# EAGLE design shift_reg (EAGLE 9.5.1)
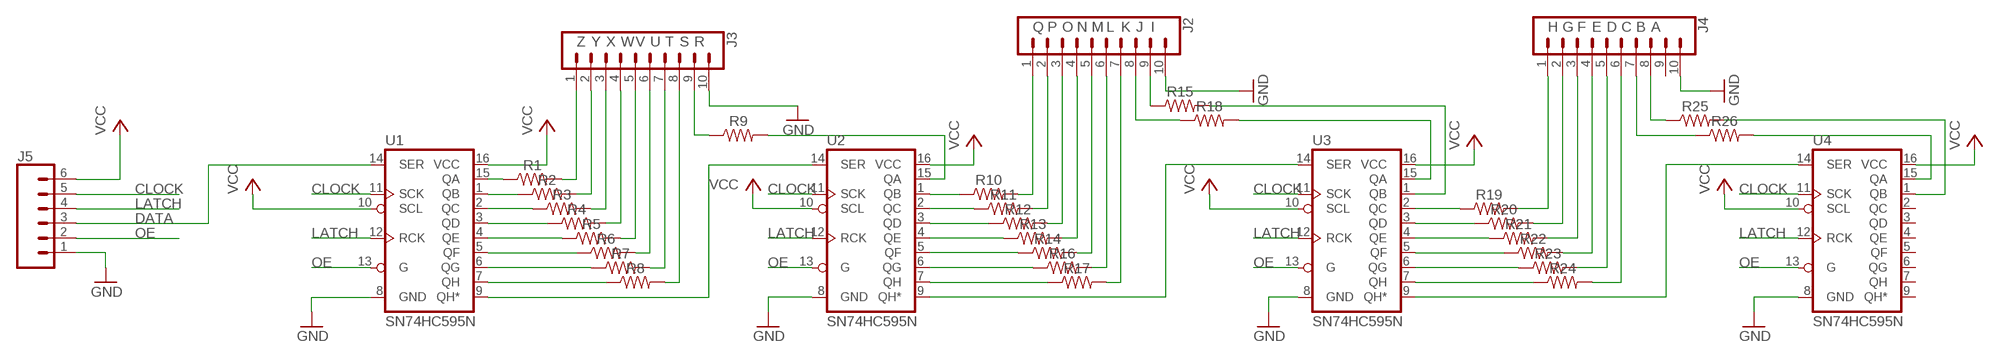
[diagram p0: schematic, sheet 1]

## Parts
J2  CONN_10"  [1X10]
J3  CONN_10"  [1X10]
J4  CONN_10"  [1X10]
J5  CONN_06LOCK  [1X06_LOCK]
R1  RESISTORAXIAL-0.3  [AXIAL-0.3]
R2  RESISTORAXIAL-0.3  [AXIAL-0.3]
R3  RESISTORAXIAL-0.3  [AXIAL-0.3]
R4  RESISTORAXIAL-0.3  [AXIAL-0.3]
R5  RESISTORAXIAL-0.3  [AXIAL-0.3]
R6  RESISTORAXIAL-0.3  [AXIAL-0.3]
R7  RESISTORAXIAL-0.3  [AXIAL-0.3]
R8  RESISTORAXIAL-0.3  [AXIAL-0.3]
R9  RESISTORAXIAL-0.3  [AXIAL-0.3]
R10  RESISTORAXIAL-0.3  [AXIAL-0.3]
R11  RESISTORAXIAL-0.3  [AXIAL-0.3]
R12  RESISTORAXIAL-0.3  [AXIAL-0.3]
R13  RESISTORAXIAL-0.3  [AXIAL-0.3]
R14  RESISTORAXIAL-0.3  [AXIAL-0.3]
R15  RESISTORAXIAL-0.3  [AXIAL-0.3]
R16  RESISTORAXIAL-0.3  [AXIAL-0.3]
R17  RESISTORAXIAL-0.3  [AXIAL-0.3]
R18  RESISTORAXIAL-0.3  [AXIAL-0.3]
R19  RESISTORAXIAL-0.3  [AXIAL-0.3]
R20  RESISTORAXIAL-0.3  [AXIAL-0.3]
R21  RESISTORAXIAL-0.3  [AXIAL-0.3]
R22  RESISTORAXIAL-0.3  [AXIAL-0.3]
R23  RESISTORAXIAL-0.3  [AXIAL-0.3]
R24  RESISTORAXIAL-0.3  [AXIAL-0.3]
R25  RESISTORAXIAL-0.3  [AXIAL-0.3]
R26  RESISTORAXIAL-0.3  [AXIAL-0.3]
U1  SN74HC595N  74HC595N  [DIP16]
U2  SN74HC595N  74HC595N  [DIP16]
U3  SN74HC595N  74HC595N  [DIP16]
U4  SN74HC595N  74HC595N  [DIP16]

## Nets
A: J4.8 R25.P$1
B: J4.7 R26.P$1
C: J4.6 R24.P$2
CLOCK: J5.5 U1.11(SCK) U2.11(SCK) U3.11(SCK) U4.11(SCK)
D: J4.5 R23.P$2
DATA: J5.3 U1.14(SER)
E: J4.4 R22.P$2
F: J4.3 R21.P$2
G: J4.2 R20.P$2
GND: J2.10 J3.10 J4.10 J5.1 U1.8(GND) U2.8(GND) U3.8(GND) U4.8(GND)
H: J4.1 R19.P$2
I: J2.9 R15.P$1
J: J2.8 R18.P$1
K: J2.7 R17.P$2
L: J2.6 R16.P$2
LATCH: J5.4 U1.12(RCK) U2.12(RCK) U3.12(RCK) U4.12(RCK)
M: J2.5 R14.P$2
N: J2.4 R13.P$2
N$2: U1.9(QH*) U2.14(SER)
N$3: R9.P$2 U2.15(QA)
N$4: R14.P$1 U2.5(QF)
N$6: R18.P$2 U3.15(QA)
N$7: R15.P$2 U3.1(QB)
N$9: R1.P$1 U1.15(QA)
N$10: R2.P$1 U1.1(QB)
N$11: R3.P$1 U1.2(QC)
N$12: R4.P$1 U1.3(QD)
N$13: R5.P$1 U1.4(QE)
N$14: R6.P$1 U1.5(QF)
N$15: R7.P$1 U1.6(QG)
N$16: R8.P$1 U1.7(QH)
N$19: R10.P$1 U2.1(QB)
N$20: R11.P$1 U2.2(QC)
N$21: R12.P$1 U2.3(QD)
N$22: R13.P$1 U2.4(QE)
N$23: R16.P$1 U2.6(QG)
N$24: R17.P$1 U2.7(QH)
N$26: R19.P$1 U3.2(QC)
N$27: R20.P$1 U3.3(QD)
N$28: U2.9(QH*) U3.14(SER)
N$29: R21.P$1 U3.4(QE)
N$30: R22.P$1 U3.5(QF)
N$31: R23.P$1 U3.6(QG)
N$32: R24.P$1 U3.7(QH)
N$35: R26.P$2 U4.15(QA)
N$36: R25.P$2 U4.1(QB)
N$37: U3.9(QH*) U4.14(SER)
O: J2.3 R12.P$2
OE: J5.2 U1.13(G) U2.13(G) U3.13(G) U4.13(G)
P: J2.2 R11.P$2
Q: J2.1 R10.P$2
R: J3.9 R9.P$1
S: J3.8 R8.P$2
T: J3.7 R7.P$2
U: J3.6 R6.P$2
V: J3.5 R5.P$2
VCC: J5.6 U1.10(SCL) U1.16(VCC) U2.10(SCL) U2.16(VCC) U3.10(SCL) U3.16(VCC) U4.10(SCL) U4.16(VCC)
W: J3.4 R4.P$2
X: J3.3 R3.P$2
Y: J3.2 R2.P$2
Z: J3.1 R1.P$2
Unconnected: J4.9 U4.2(QC) U4.3(QD) U4.4(QE) U4.5(QF) U4.6(QG) U4.7(QH) U4.9(QH*)

## Library data of the parts
J2-J4 = shift_register:CONN_10: Multi connection point. Often used as Generic Header-pin footprint for 0.1 inch spaced/style header connections On any of the 0.1 inch spaced packages, you can populate with these: Break Away Headers - Straight <https://www.sparkfun.com/products/116> (PRT-00116) Break Away Male Headers - Right Angle <https://www.sparkfun.com/products/553> (PRT-00553) Female Headers <https://www.sparkfun.com/products/115> (PRT-00115) Break Away Headers - Machine Pin <https://www.sparkfun.com/products/117> (PRT-00117) Break Away Female Headers - Swiss Machine Pin <https://www.sparkfun.com/products/743> (PRT-00743) Arduino Stackable Header - 10 Pin <https://www.sparkfun.com/products/11376> (PRT-11376) For SCREWTERMINALS and SPRING TERMINALS visit here: Screw Terimnals on SparkFun.com <https://www.sparkfun.com/search/results?term=Screw+Terminals> (5mm/3.5mm/2.54mm spacing) This device is also useful as a general connection point to wire up your design to another part of your project. Our various solder wires solder well into these plated through hole pads. Hook-Up Wire - Assortment (Stranded, 22 AWG) <https://www.sparkfun.com/products/11375> (PRT-11375) Hook-Up Wire - Assortment (Solid Core, 22 AWG) <https://www.sparkfun.com/products/11367> (PRT-11367) View the entire wire category on our website here <https://www.sparkfun.com/categories/141> Special notes: Molex polarized connector foot print use with SKU : PRT-08231 with associated crimp pins and housings. 1MM SMD Version SKU: PRT-10208 NOTES ON THE VARIANTS LOCK and LOCK_LONGPADS... This footprint was designed to help hold the alignment of a through-hole component (i.e. 6-pin header) while soldering it into place. You may notice that each hole has been shifted either up or down by 0.005 of an inch from it's more standard position (which is a perfectly straight line). This slight alteration caused the pins (the squares in the middle) to touch the edges of the holes. Because they are alternating, it causes a "brace" to hold the component in place. 0.005 has proven to be the perfect amount of "off-center" position when using our standard breakaway headers. Although looks a little odd when you look at the bare footprint, once you have a header in there, the alteration is very hard to notice. Also,if you push a header all the way into place, it is covered up entirely on the bottom side.; PROD_ID: CONN-11563
J5 = SparkFun-Connectors:CONN_06: Multi connection point. Often used as Generic Header-pin footprint for 0.1 inch spaced/style header connections On any of the 0.1 inch spaced packages, you can populate with these: Break Away Headers - Straight <https://www.sparkfun.com/products/116> (PRT-00116) Break Away Male Headers - Right Angle <https://www.sparkfun.com/products/553> (PRT-00553) Female Headers <https://www.sparkfun.com/products/115> (PRT-00115) Break Away Headers - Machine Pin <https://www.sparkfun.com/products/117> (PRT-00117) Break Away Female Headers - Swiss Machine Pin <https://www.sparkfun.com/products/743> (PRT-00743) Arduino Stackable Header - 6 Pin <https://www.sparkfun.com/products/9280> (PRT-09280) For SCREWTERMINALS and SPRING TERMINALS visit here: Screw Terimnals on SparkFun.com <https://www.sparkfun.com/search/results?term=Screw+Terminals> (5mm/3.5mm/2.54mm spacing) This device is also useful as a general connection point to wire up your design to another part of your project. Our various solder wires solder well into these plated through hole pads. Hook-Up Wire - Assortment (Stranded, 22 AWG) <https://www.sparkfun.com/products/11375> (PRT-11375) Hook-Up Wire - Assortment (Solid Core, 22 AWG) <https://www.sparkfun.com/products/11367> (PRT-11367) View the entire wire category on our website here <https://www.sparkfun.com/categories/141>
R1-R26 = SparkFun-Resistors:RESISTOR: Generic Resistor Package
U1-U4 = SparkFun-IC-Logic:74*595: 8-Bit Shift Register (Serial to Parallel) Datasheet <http://cdn.sparkfun.com/datasheets/BreakoutBoards/MM74HC595.pdf> SparkFun Products SparkFun Shift Register Breakout - 74HC595 <https://www.sparkfun.com/products/10680> (BOB-10680); PROD_ID: IC-13123

## Board
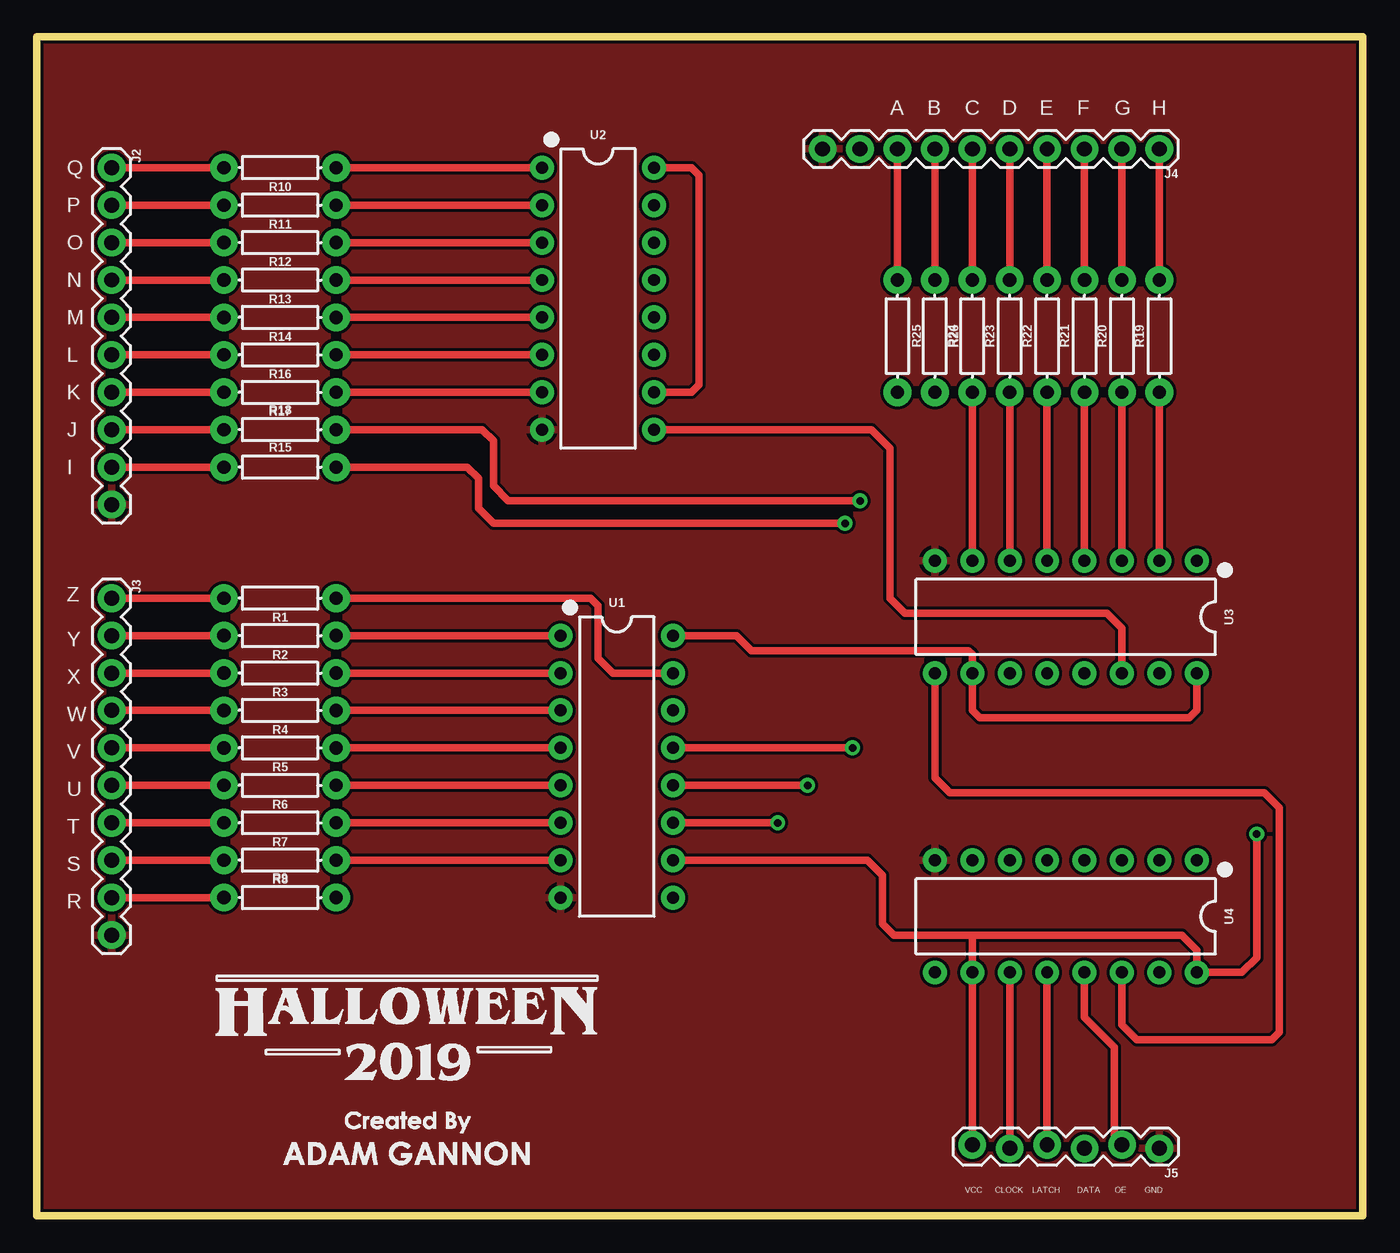
[diagram p1: board, top side]
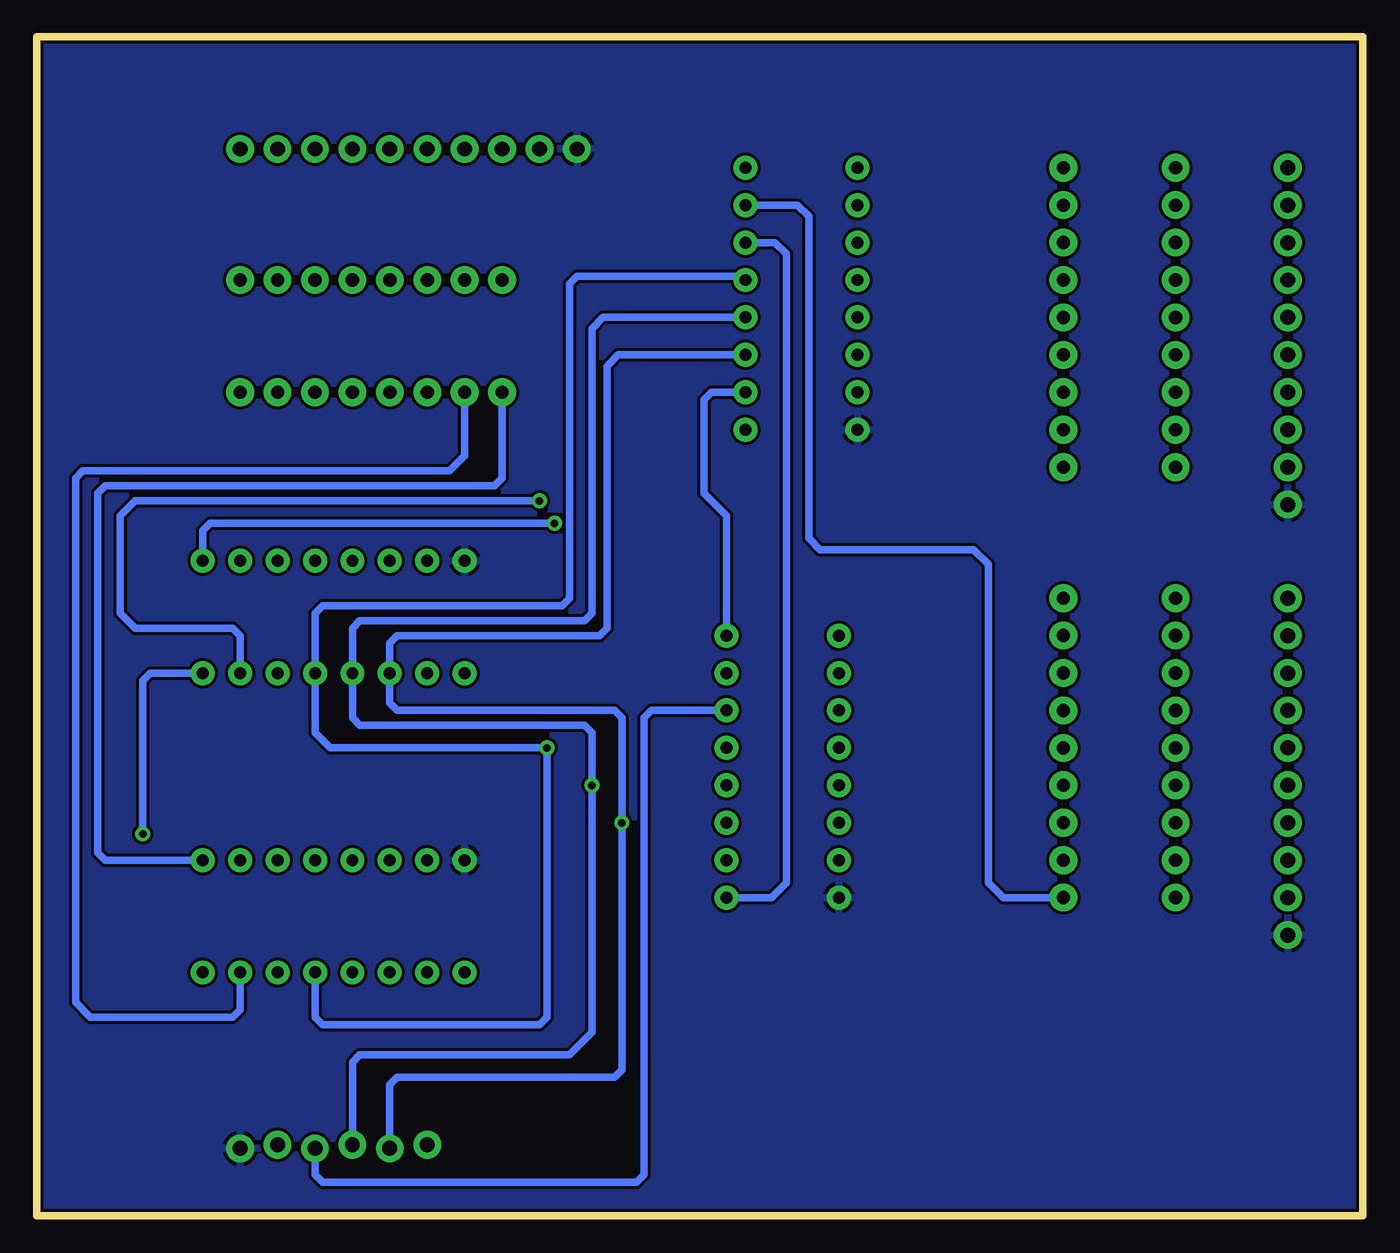
[diagram p2: board, bottom side, seen from below]

Size 90 x 80 mm. Coordinates in mm from the lower left corner, seen from the top.
Outline: 0,80 0,0 90,0 90,80 0,80
Copper layers (1*16): Top 0.035mm / dielectric 1.5mm / Bottom 0.035mm
Design rules "SparkFun": minimum track width 8mil, minimum drill 20mil, track to track 8mil, track to pad 8mil, pad to pad 8mil, via to via 8mil, smd to smd 8mil, copper to edge 8mil, drill to drill 8mil, minimum pad ring 12mil, minimum via ring 10mil, stop-mask expansion 4mil, vias tented up to drill 20mil, thermal gap 10mil

### Footprints (pad centres in the part's own frame; a part is rotated, then mirrored left to right if it is on the bottom)
1X10 = drill 1.016 pad 1.88: 1 0,0; 2 2.54,0; 3 5.08,0; 4 7.62,0; 5 10.16,0; 6 12.7,0; 7 15.24,0; 8 17.78,0; 9 20.32,0; 10 22.86,0
1X06_LOCK = drill 1.016 pad 1.88: 1 0,0; 2 2.54,-0.254; 3 5.08,0; 4 7.62,-0.254; 5 10.16,0; 6 12.7,-0.254
AXIAL-0.3 = drill 0.9 pad 1.88: P$1 -3.81,0; P$2 3.81,0
DIP16 = drill 0.813 pad 1.626: 1 -8.89,-3.81; 2 -6.35,-3.81; 3 -3.81,-3.81; 4 -1.27,-3.81; 5 1.27,-3.81; 6 3.81,-3.81; 7 6.35,-3.81; 8 8.89,-3.81; 9 8.89,3.81; 10 6.35,3.81; 11 3.81,3.81; 12 1.27,3.81; 13 -1.27,3.81; 14 -3.81,3.81; 15 -6.35,3.81; 16 -8.89,3.81

### Placement (x,y rotation side)
J2  5.08,71.12 270 top
J3  5.08,41.91 270 top
J4  76.2,72.39 180 top
J5  76.2,4.57 180 top
R1  16.51,41.91 180 top
R2  16.51,39.37 180 top
R3  16.51,36.83 180 top
R4  16.51,34.29 180 top
R5  16.51,31.75 180 top
R6  16.51,29.21 180 top
R7  16.51,26.67 180 top
R8  16.51,24.13 180 top
R9  16.51,21.59 0 top
R10  16.51,71.12 180 top
R11  16.51,68.58 180 top
R12  16.51,66.04 180 top
R13  16.51,63.5 180 top
R14  16.51,60.96 180 top
R15  16.51,50.8 0 top
R16  16.51,58.42 180 top
R17  16.51,55.88 180 top
R18  16.51,53.34 0 top
R19  76.2,59.69 90 top
R20  73.66,59.69 90 top
R21  71.12,59.69 90 top
R22  68.58,59.69 90 top
R23  66.04,59.69 90 top
R24  63.5,59.69 90 top
R25  58.42,59.69 270 top
R26  60.96,59.69 270 top
U1  39.37,30.48 270 top
U2  38.1,62.23 270 top
U3  69.85,40.64 180 top
U4  69.85,20.32 180 top

### Tracks (layer width: path | path; a pad name or v marks a point on that pad's centre or on a via)
A
  Top 0.508: R25.P$1 J4.8
B
  Top 0.508: J4.7 R26.P$1
C
  Top 0.508: R24.P$2 J4.6
CLOCK  (via drill 0.51)
  Top 0.508: J5.5 U4.11 | U1.11 v50.29,26.67
  Bottom 0.508: J5.5 66.04,8.89 65.53,9.4 50.8,9.4 50.29,9.91 v50.29,26.67 50.29,33.78 50.8,34.29 65.53,34.29 66.04,34.8 U3.11 66.04,38.86 65.53,39.37 51.82,39.37 51.31,39.88 51.31,57.66 50.55,58.42 U2.11
D
  Top 0.508: J4.5 R23.P$2
DATA
  Bottom 0.508: U1.14 48.26,34.29 48.77,33.78 48.77,2.79 49.28,2.29 70.61,2.29 71.12,2.79 J5.3
E
  Top 0.508: R22.P$2 J4.4
F
  Top 0.508: J4.3 R21.P$2
G
  Top 0.508: R20.P$2 J4.2
GND
  pour Top: 0,0 0,80.01 22.86,80.01 90.17,80.01 90.17,0
  pour Bottom: 0,0 0,80.01 86.36,80.01 90.17,80.01 90.17,2.54 90.17,0
H
  Top 0.508: J4.1 R19.P$2
I
  Top 0.508: J2.9 R15.P$1
J
  Top 0.508: R18.P$1 J2.8
K
  Top 0.508: J2.7 R17.P$2
L
  Top 0.508: R16.P$2 J2.6
LATCH  (via drill 0.51)
  Top 0.508: U4.12 J5.4 | U1.12 v52.32,29.21
  Bottom 0.508: J5.4 68.58,10.41 68.07,10.92 53.85,10.92 52.32,12.45 v52.32,29.21 52.32,32.77 52.83,33.27 68.07,33.27 68.58,33.78 U3.12 68.58,39.88 68.07,40.39 52.83,40.39 52.32,40.89 52.32,60.2 51.56,60.96 U2.12
M
  Top 0.508: R14.P$2 J2.5
N
  Top 0.508: J2.4 R13.P$2
N$2
  Bottom 0.508: U2.14 39.88,66.04 39.12,65.28 39.12,22.61 40.13,21.59 U1.9
N$3
  Bottom 0.508: U2.15 38.35,68.58 37.59,67.82 37.59,45.97 36.83,45.21 26.42,45.21 25.4,44.2 25.4,22.61 24.38,21.59 R9.P$2
N$4
  Top 0.508: U2.5 R14.P$1
N$6  (via drill 0.51)
  Top 0.508: R18.P$2 30.23,53.34 30.99,52.58 30.99,49.53 32,48.51 v55.88,48.51
  Bottom 0.508: v55.88,48.51 83.31,48.51 84.33,47.5 84.33,40.89 83.31,39.88 76.71,39.88 76.2,39.37 U3.15
N$7  (via drill 0.51)
  Top 0.508: R15.P$2 29.21,50.8 29.97,50.04 29.97,48.01 30.99,46.99 v54.86,46.99
  Bottom 0.508: U3.1 78.74,46.48 78.23,46.99 v54.86,46.99
N$9
  Top 0.508: U1.15 39.12,36.83 38.1,37.85 38.1,41.4 37.59,41.91 R1.P$1
N$10
  Top 0.508: R2.P$1 U1.1
N$11
  Top 0.508: U1.2 R3.P$1
N$12
  Top 0.508: R4.P$1 U1.3
N$13
  Top 0.508: U1.4 R5.P$1
N$14
  Top 0.508: R6.P$1 U1.5
N$15
  Top 0.508: R7.P$1 U1.6
N$16
  Top 0.508: U1.7 R8.P$1
N$19
  Top 0.508: R10.P$1 U2.1
N$20
  Top 0.508: U2.2 R11.P$1
N$21
  Top 0.508: R12.P$1 U2.3
N$22
  Top 0.508: U2.4 R13.P$1
N$23
  Top 0.508: R16.P$1 U2.6
N$24
  Top 0.508: U2.7 R17.P$1
N$26
  Top 0.508: R19.P$1 U3.2
N$27
  Top 0.508: U3.3 R20.P$1
N$28
  Top 0.508: U3.14 73.66,39.88 72.64,40.89 58.93,40.89 57.91,41.91 57.91,52.07 56.64,53.34 U2.9
N$29
  Top 0.508: R21.P$1 U3.4
N$30
  Top 0.508: U3.5 R22.P$1
N$31
  Top 0.508: R23.P$1 U3.6
N$32
  Top 0.508: U3.7 R24.P$1
N$35
  Bottom 0.508: R26.P$2 60.96,51.56 61.98,50.55 86.87,50.55 87.38,50.04 87.38,14.48 86.36,13.46 76.71,13.46 76.2,13.97 U4.15
N$36
  Bottom 0.508: R25.P$2 58.42,50.04 58.93,49.53 85.34,49.53 85.85,49.02 85.85,24.64 85.34,24.13 U4.1
N$37
  Top 0.508: U3.9 60.96,29.72 61.98,28.7 83.31,28.7 84.33,27.69 84.33,12.45 83.82,11.94 74.68,11.94 73.66,12.95 U4.14
O
  Top 0.508: R12.P$2 J2.3
OE  (via drill 0.51)
  Top 0.508: J5.2 73.15,5.33 73.15,11.43 71.12,13.46 U4.13 | U1.13 v55.37,31.75
  Bottom 0.508: U4.13 71.12,13.46 70.61,12.95 55.88,12.95 55.37,13.46 v55.37,31.75 70.1,31.75 71.12,32.77 U3.13 71.12,40.89 70.61,41.4 54.36,41.4 53.85,41.91 53.85,63.25 53.34,63.75 42.16,63.75 U2.13
P
  Top 0.508: J2.2 R11.P$2
Q
  Top 0.508: R10.P$2 J2.1
R
  Top 0.508: R9.P$1 J3.9
S
  Top 0.508: J3.8 R8.P$2
T
  Top 0.508: R7.P$2 J3.7
U
  Top 0.508: J3.6 R6.P$2
V
  Top 0.508: R5.P$2 J3.5
VCC  (via drill 0.51)
  Top 0.508: J5.6 U4.10 63.5,19.05 | 63.5,19.05 77.72,19.05 78.74,18.03 U4.16 81.79,16.51 82.8,17.53 v82.8,25.91 | U1.16 47.5,39.37 48.51,38.35 63.25,38.35 63.5,38.1 U3.10 63.5,34.29 64.01,33.78 78.23,33.78 78.74,34.29 U3.16 | U2.16 44.45,71.12 44.96,70.61 44.96,56.39 44.45,55.88 U2.10 | U1.10 56.39,24.13 57.4,23.11 57.4,19.81 58.17,19.05 63.5,19.05
  Bottom 0.508: U1.16 43.18,47.5 44.7,49.02 44.7,55.37 44.2,55.88 U2.10 | U3.16 82.3,36.83 82.8,36.32 v82.8,25.91
W
  Top 0.508: J3.4 R4.P$2
X
  Top 0.508: R3.P$2 J3.3
Y
  Top 0.508: J3.2 R2.P$2
Z
  Top 0.508: R1.P$2 J3.1

### Text on the board
tPlace: A | B | C | D | E | F | G | H | Q | P | O | N | M | L | K | J | I | Z | Y | X | W | V | U | T | S | R | VCC | CLOCK | LATCH | DATA | OE | GND | C:/Users/Adam/Desktop/logo1.bmp | C:/Users/Adam/Desktop/logo2.bmp